# Altium schematic sheet part1.SchDoc
size A4; SheetNumber: 1; SheetTotal: 2
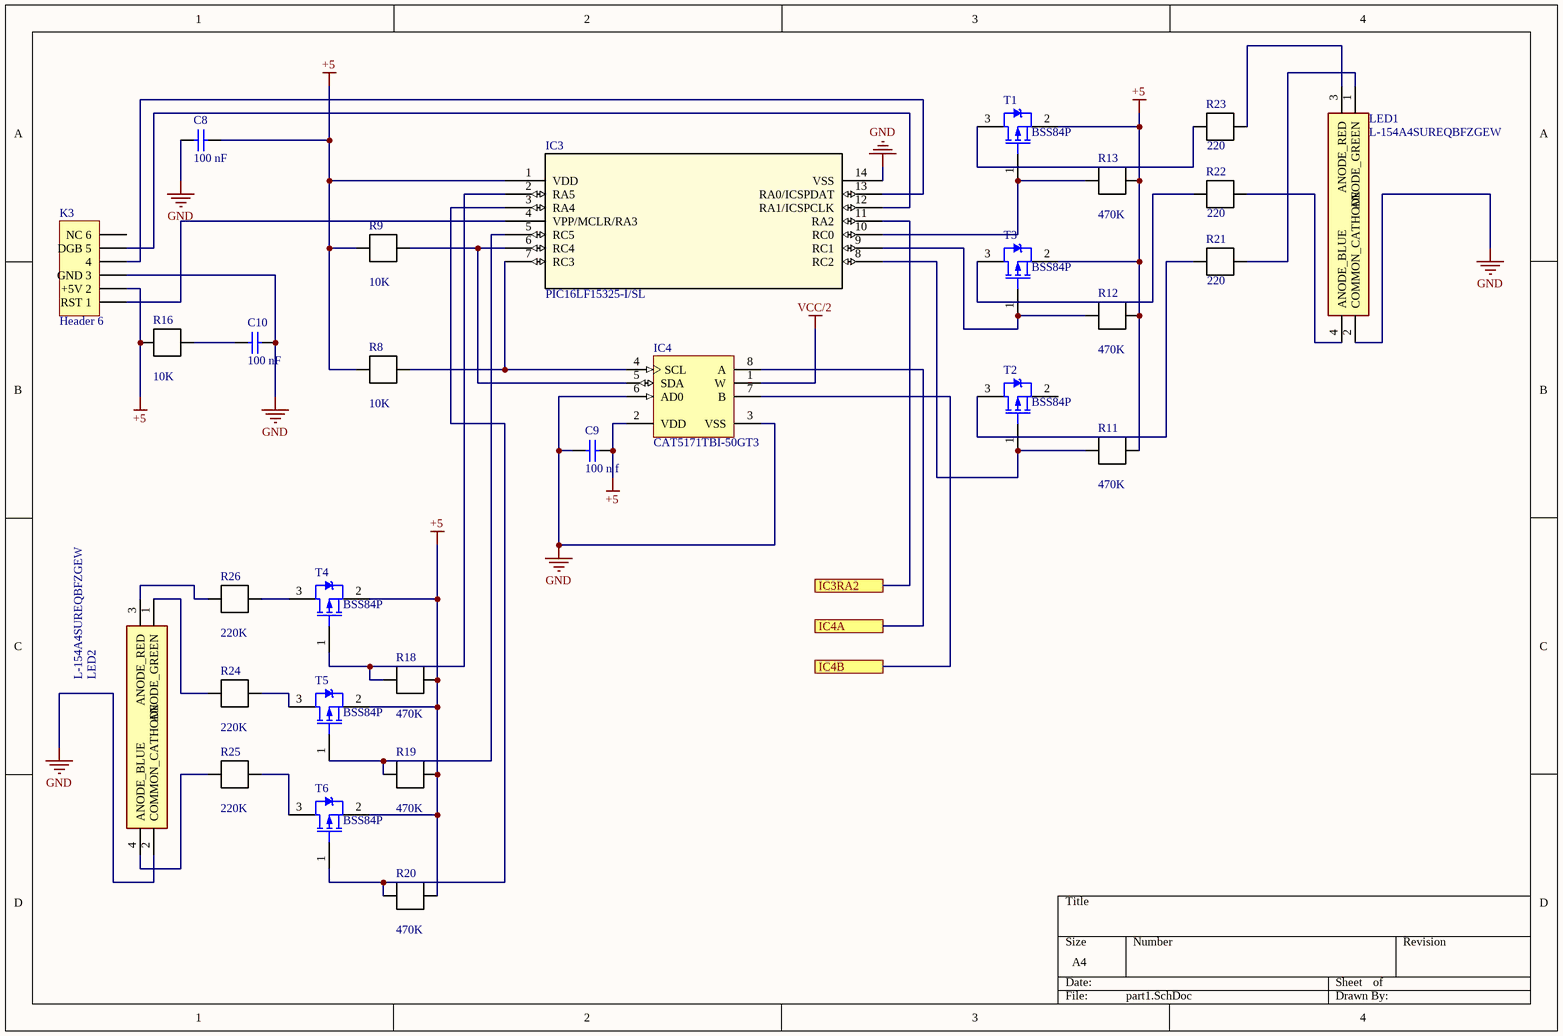
[diagram p0: part1.SchDoc]

## Parts
C8  100 nF  [CAPC2013X70X45NL10T25]
C9  100 n f  [CAPC2013X70X45NL10T25]
C10  100 nF  [CAPC2013X70X45NL10T25]
IC3  PIC16LF15325-I/SL  [SOIC14_SL_MCH]
IC4  CAT5171TBI-50GT3  [ONSC-SOT23-8-527AK-01_N]
K3  Header 6  [HDR1X6]
LED1  L-154A4SUREQBFZGEW  [L-154A4SUREQBFZGEC]
LED2  L-154A4SUREQBFZGEW  [L-154A4SUREQBFZGEC]
R8  value 10K  [6-0805_M]
R9  value 10K  [6-0805_M]
R11  value 470K  [C1206]
R12  value 470K  [C1206]
R13  value 470K  [C1206]
R16  value 10K  [6-0805_M]
R18  value 470K  [C1206]
R19  value 470K  [C1206]
R20  value 470K  [C1206]
R21  value 220  [C1206]
R22  value 220  [C1206]
R23  value 220  [C1206]
R24  value 220K  [C1206]
R25  value 220K  [C1206]
R26  value 220K  [C1206]
T1  BSS84P  [INF-PG-SOT23_N]
T2  BSS84P  [INF-PG-SOT23_N]
T3  BSS84P  [INF-PG-SOT23_N]
T4  BSS84P  [INF-PG-SOT23_N]
T5  BSS84P  [INF-PG-SOT23_N]
T6  BSS84P  [INF-PG-SOT23_N]

## Ports
IC3RA2, IC4A, IC4B

## Nets
+5: C8.2 C9.2 IC3.1(VDD) IC4.2(VDD) K3.2(+5V_2) R8.1 R9.1 R11.2 R12.2 R13.2 R16.1 R18.2 R19.2 R20.2 T1.2(SOURCE) T3.2(SOURCE) T4.2(SOURCE) T5.2(SOURCE) T6.2(SOURCE)
GND: C8.1 C9.1 C10.2 IC3.14(VSS) IC4.3(VSS) IC4.6(AD0) K3.3(GND_3) LED1.2(COMMON_CATHODE) LED2.2(COMMON_CATHODE)
VCC/2: IC4.1(W)
IC3RA2: IC3.11(RA2) ; port IC3RA2
IC4A: IC4.8(A) ; port IC4A
IC4B: IC4.7(B) ; port IC4B
NetC10_1: C10.1 R16.2
NetIC3_2: IC3.2(RA5) R18.1 T4.1(GATE)
NetIC3_3: IC3.3(RA4) R20.1 T6.1(GATE)
NetIC3_4: IC3.4(VPP/MCLR/RA3) K3.1(RST_1)
NetIC3_5: IC3.5(RC5) R19.1 T5.1(GATE)
NetIC3_6: IC3.6(RC4) IC4.5(SDA) R9.2
NetIC3_7: IC3.7(RC3) IC4.4(SCL) R8.2
NetIC3_8: IC3.8(RC2) R11.1 T2.1(GATE)
NetIC3_9: IC3.9(RC1) R12.1 T3.1(GATE)
NetIC3_10: IC3.10(RC0) R13.1 T1.1(GATE)
NetIC3_12: IC3.12(RA1/ICSPCLK) K3.5(DGB_5)
NetIC3_13: IC3.13(RA0/ICSPDAT) K3.4
NetLED1_1: LED1.1(ANODE_GREEN) R21.2
NetLED1_3: LED1.3(ANODE_RED) R23.2
NetLED1_4: LED1.4(ANODE_BLUE) R22.2
NetLED2_1: LED2.1(ANODE_GREEN) R24.1
NetLED2_3: LED2.3(ANODE_RED) R26.1
NetLED2_4: LED2.4(ANODE_BLUE) R25.1
NetR21_1: R21.1 T2.3(DRAIN)
NetR22_1: R22.1 T3.3(DRAIN)
NetR23_1: R23.1 T1.3(DRAIN)
NetR24_2: R24.2 T5.3(DRAIN)
NetR25_2: R25.2 T6.3(DRAIN)
NetR26_2: R26.2 T4.3(DRAIN)

Not connected (* = marked no-connect by the designer): K3 6(NC_6); T2 2(SOURCE)

## Library data of the parts
C8-C10 = CMP-2007-00889-1: Manufacturer: Murata; Part Number: GRM2165C1H332JA01D
IC3 = PIC16LF15325-I/SL: No Description Available; Vendor: Microchip; Built_By: EMA_Cory; SourceLibrary: Microchip_2020-03-04; Datasheet: http://ww1.microchip.com/downloads/en/DeviceDoc/PIC16-L-F15325-45-Data-Sheet-40001865D.pdf; Manufacturer_Part_Number: PIC16LF15325-I/SL; Copyright: Copyright (C) 2018 Accelerated Designs. All rights reserved; RefDes: RefDes; Type: DEV
IC4 = CMP-1317-00202-1: 256-Position I2C Compatible Digital Potentiometer (POT), -40 to 85 degC, 8-Pin SOT23, Pb-Free, Tape and Reel; Manufacturer: On Semiconductor; # of Pots: 1; VDD Max (V): 5.5; # of Taps: 256; Code_JEDEC: MO-178; RoHS: TRUE; ComponentLink1URL: http://www.onsemi.com/; ComponentLink3URL: http://www.onsemi.com/pub_link/Collateral/527AK.PDF; PackageDescription: 8-Pin Small Outline Transistor, Body 2.9 x 1.6 mm, Pitch 0.65 mm; ComponentLink3Description: Package Specification; PackageReference: SOT23-8-527AK-01; ComponentLink1Description: Manufacturer URL; PartNumber: CAT5171TBI-50GT3; PackageVersion: Rev. A, 03/2009; Packing: Tape and Reel; DatasheetVersion: Rev. 2; Mounting Technology: Surface Mount; ComponentLink2URL: http://www.onsemi.com/pub_link/Collateral/CAT5171-D.PDF; Control Interface: I2C; Type: Potentiometer; ComponentLink2Description: Datasheet
K3 = Header 6: Header, 6-Pin; LatestRevisionDate: 17-Jul-2002; LatestRevisionNote: Re-released for DXP Platform.; Publisher: Altium Limited
LED1 LED2 = L-154A4SUREQBFZGEW: LED; Manufacturer_Name: Kingbright; Datasheet Link: http://www.kingbright.com/attachments/file/psearch/000/00/00/L-154A4SUREQBFZGEW(Ver.11A).pdf; Manufacturer_Part_Number: L-154A4SUREQBFZGEW; Mouser Part Number: N/A; Mouser Price/Stock: https://www.mouser.co.uk/ProductDetail/Kingbright/L-154A4SUREQBFZGEW?qs=2JU0tDl2GZ3s0DU5fkfHGQ%3D%3D
R8 R9 R11-R13 R16 R18-R26 = Res1: Resistor; Published: 8-Jun-2000; LatestRevisionDate: 17-Jul-2002; LatestRevisionNote: Re-released for DXP Platform.; PackageReference: AXIAL-0.3; Publisher: Altium Limited; PackageDescription: Axial Device, Thru-Hole; 2 Leads; 0.3 in Pin Spacing; Supplier 1: RSComponents
T1-T6 = CMP-1099-00028-1: P-Channel SIPMOS Small-Signal-Transistor, -60 V VDS, -0.17 A ID, -55 to 150 degC, PG-SOT23, Reel, Green; Manufacturer: Infineon; VGS(th) (max): -2Â V; VGS(th) (min): -1Â V; VDS (max): -60Â V; Rth: 350Â K/W; Pto t (max): 0.36Â W; ID (max): -0.17Â A; IDpuls (max): -0.68Â A; RDS (on) (max) (@4.5V): 12,000Â mOhm; QG: 1Â nC; Green: TRUE; RDS (on) (max): 8,000Â mOhm; ComponentLink3URL: http://www.infineon.com/dgdl/SOT23-Package_Overview.pdf?folderId=db3a30431936bc4b0119532290053c66&fileId=db3a30431936bc4b0119533468123c85; ComponentLink3Description: Package Specification; Packing: Reel; PartNumber: BSS84P; ComponentLink2Description: Datasheet; Mounting Technology: Surface Mount; ComponentLink2URL: http://www.infineon.com/dgdl/BSS84P_Rev2.7%5B1%5D.pdf?folderId=db3a304314dca38901154a72e3951a65&fileId=db3a304330f68606013118ac7a9b4549; PackageReference: PG-SOT23; ComponentLink1URL: http://www.infineon.com/; PackageVersion: Apr-08; ComponentLink1Description: Manufacturer URL; PackageDescription: 3-Pin Small Outline Transistor Package, 2.9 x 1.3 mm Body, 0.95 mm Pitch; Halogen-free: TRUE; DatasheetVersion: Rev. 2.7